# EAGLE schematic arduino (EAGLE 6.1)
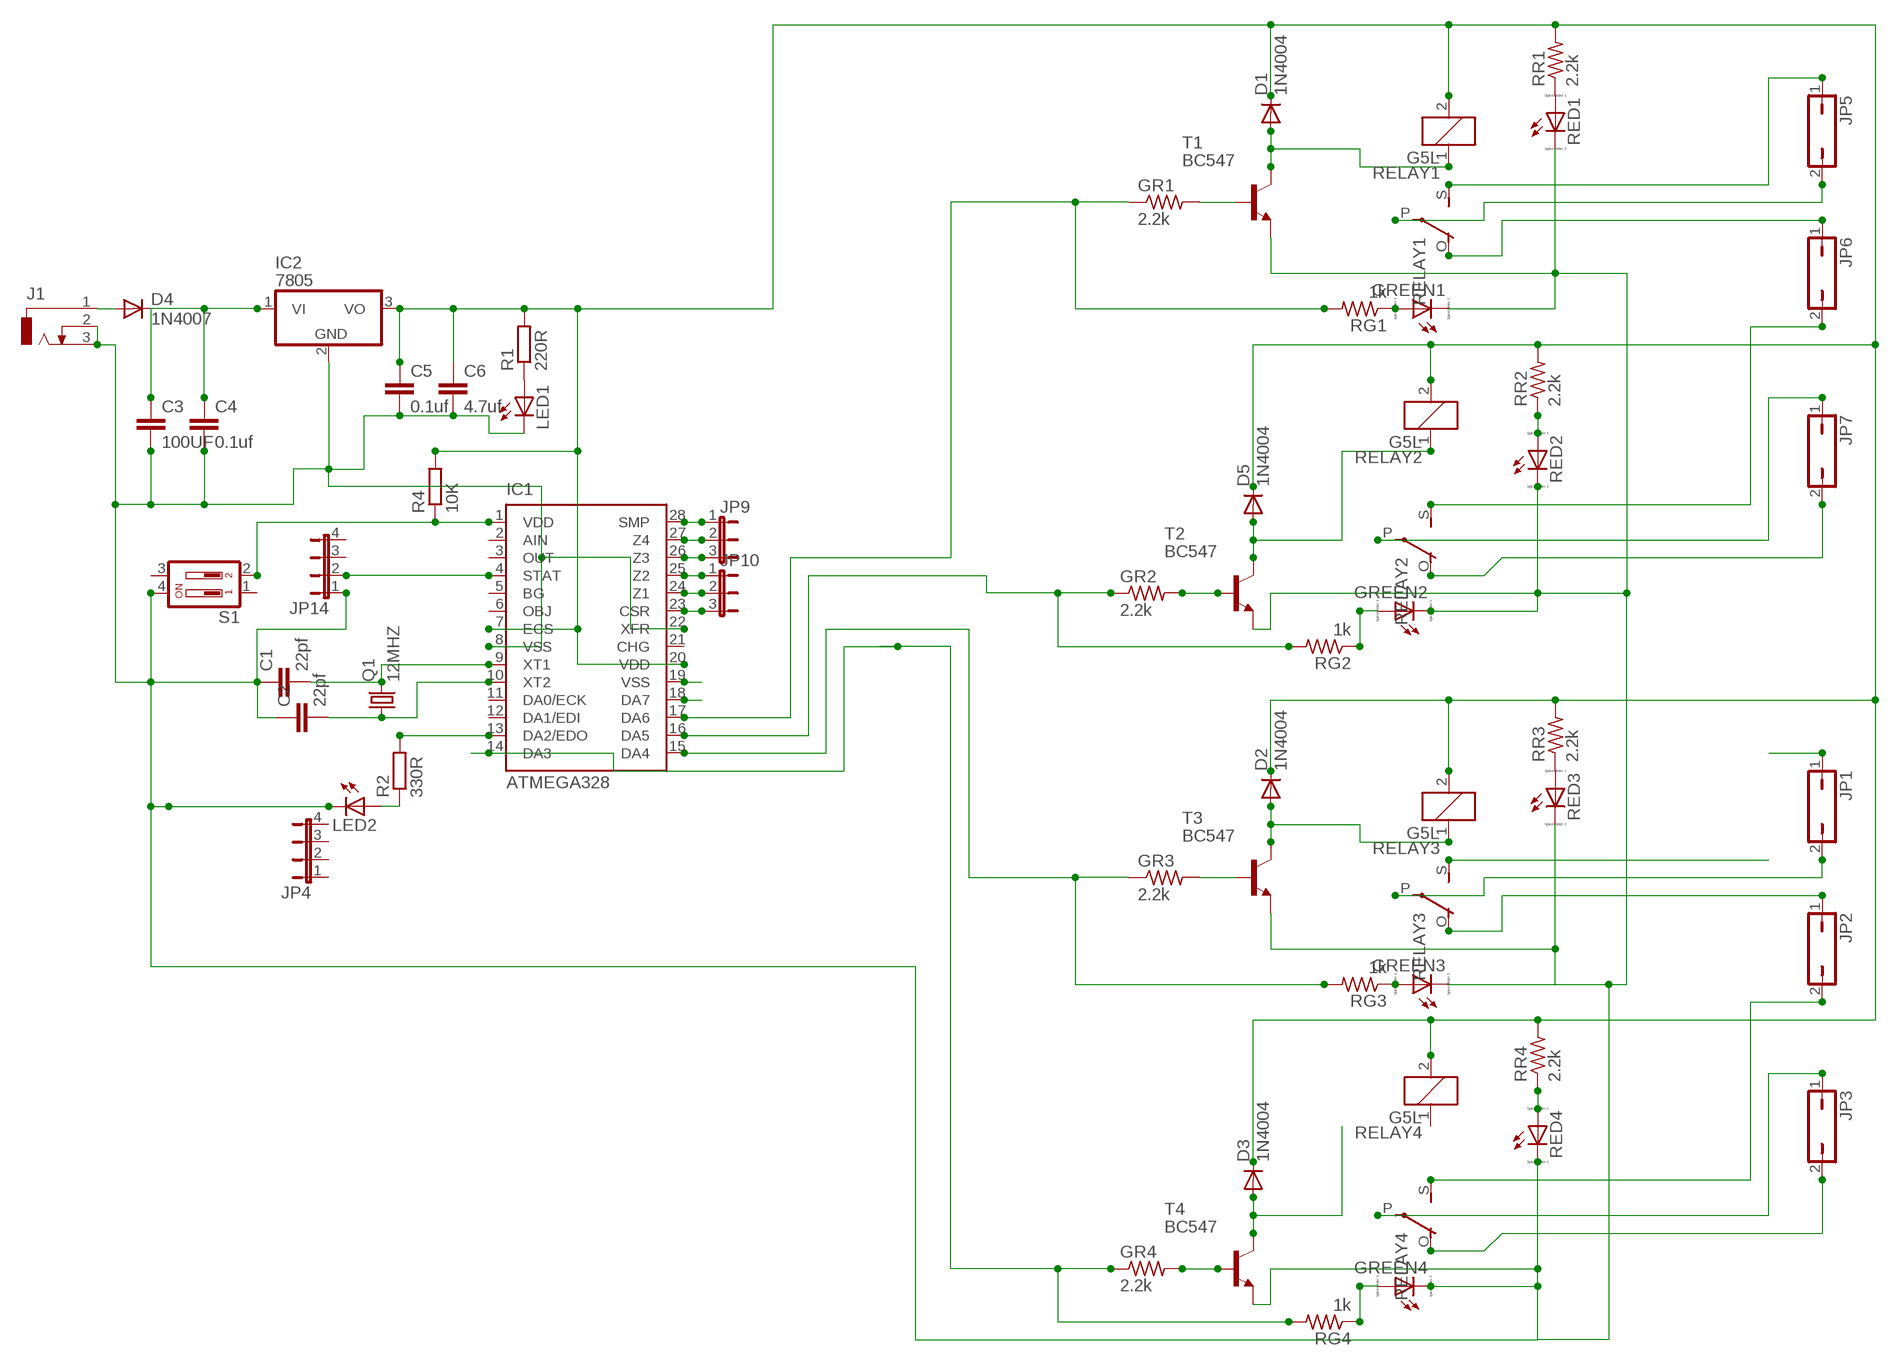
[diagram p0: schematic, sheet 1]

## Parts
C1  22pf  C2.5/2  [C2.5-2]
C2  22pf  C2.5/2  [C2.5-2]
C3  100UF  C2.5/2  [C2.5-2]
C4  0.1uf  C2.5/2  [C2.5-2]
C5  0.1uf  C2.5/2  [C2.5-2]
C6  4.7uf  C2.5/2  [C2.5-2]
D1  1N4004  [DO41-10]
D2  1N4004  [DO41-10]
D3  1N4004  [DO41-10]
D4  1N4007  1N4004  [DO41-10]
D5  1N4004  [DO41-10]
GR1  2.2k  R-US_0204/7  [0204/7]
GR2  2.2k  R-US_0204/7  [0204/7]
GR3  2.2k  R-US_0204/7  [0204/7]
GR4  2.2k  R-US_0204/7  [0204/7]
GREEN1  LED_ELD260  [LED_LD260]
GREEN2  LED_ELD260  [LED_LD260]
GREEN3  LED_ELD260  [LED_LD260]
GREEN4  LED_ELD260  [LED_LD260]
IC1  ATMEGA328  QT9701BD  [DIL28-3]
IC2  7805  786TV  [TO220V]
J1  DCJ0303  [DCJ0303]
JP1  JP1Q  [JP1]
JP2  JP1Q  [JP1]
JP3  JP1Q  [JP1]
JP4  JP4E  [JP4]
JP5  JP1Q  [JP1]
JP6  JP1Q  [JP1]
JP7  JP1Q  [JP1]
JP9  JP2E  [JP2]
JP10  JP2E  [JP2]
JP14  JP4E  [JP4]
LED1  LED3MM  [LED3MM]
LED2  LED3MM  [LED3MM]
Q1  12MHZ  CRYSTALHC49S  [HC49/S]
R1  220R  R-EU_0207/10  [0207/10]
R2  330R  R-EU_0207/10  [0207/10]
R4  10K  R-EU_0207/10  [0207/10]
RED1  LED_ELD260  [LED_LD260]
RED2  LED_ELD260  [LED_LD260]
RED3  LED_ELD260  [LED_LD260]
RED4  LED_ELD260  [LED_LD260]
RELAY1  G5L  [G5LE]
RELAY2  G5L  [G5LE]
RELAY3  G5L  [G5LE]
RELAY4  G5L  [G5LE]
RG1  1k  R-US_0204/7  [0204/7]
RG2  1k  R-US_0204/7  [0204/7]
RG3  1k  R-US_0204/7  [0204/7]
RG4  1k  R-US_0204/7  [0204/7]
RR1  2.2k  R-US_0204/7  [0204/7]
RR2  2.2k  R-US_0204/7  [0204/7]
RR3  2.2k  R-US_0204/7  [0204/7]
RR4  2.2k  R-US_0204/7  [0204/7]
S1  DP02  [DP-02]
T1  BC547  [TO92]
T2  BC547  [TO92]
T3  BC547  [TO92]
T4  BC547  [TO92]

## Nets
N$1: D1.A RELAY1.1 T1.3(C)
N$2: JP1.1
N$3: RED1.A RR1.1
N$4: C1.2 IC1.9(XT1) Q1.2
N$5: GR1.2 T1.2(B)
N$7: D5.A RELAY2.1 T2.3(C)
N$8: JP5.1 RELAY1.S(2:S)
N$9: JP6.1 RELAY1.O(2:O)
N$10: JP5.2 RELAY1.P(2:P)
N$11: GREEN1.A RG1.1
N$12: D2.A RELAY3.1 T3.3(C)
N$13: RED2.A RR2.1
N$14: C2.2 IC1.10(XT2) Q1.1
N$15: GR2.2 T2.2(B)
N$17: JP6.2 RELAY2.S(2:S)
N$18: JP7.2 RELAY2.O(2:O)
N$19: JP7.1 RELAY2.P(2:P)
N$20: GREEN2.A RG2.1
N$21: C1.1 C2.1 C3.2 C4.2 C5.2 C6.2 GREEN1.K(C) GREEN2.K(C) GREEN3.K(C) GREEN4.K(C) IC1.8(VSS) IC1.22(XFR) IC2.2(GND) J1.2 J1.3 JP14.1 LED1.K(C) LED2.K(C) RED1.K(C) RED2.K(C) RED3.K(C) RED4.K(C) S1.4 T1.1(E) T2.1(E) T3.1(E) T4.1(E)
N$22: RED3.A RR3.1
N$23: IC1.4(STAT) JP14.2
N$24: GR3.2 T3.2(B)
N$26: RELAY3.S(2:S)
N$27: JP2.1 RELAY3.O(2:O)
N$28: JP1.2 RELAY3.P(2:P)
N$29: GREEN3.A RG3.1
N$30: D3.A T4.3(C)
N$31: RED4.A RR4.1
N$32: C3.1 C4.1 D4.C IC2.1(VI)
N$33: GR4.2 T4.2(B)
N$35: JP2.2 RELAY4.S(2:S)
N$36: JP3.2 RELAY4.O(2:O)
N$37: JP3.1 RELAY4.P(2:P)
N$38: GREEN4.A RG4.1
N$39: D4.A J1.1
N$40: C5.1 C6.1 D1.C D2.C D3.C D5.C IC1.7(ECS) IC1.20(VDD) IC2.3(VO) R1.2 R4.2 RELAY1.2 RELAY2.2 RELAY3.2 RELAY4.2 RR1.2 RR2.2 RR3.2 RR4.2
N$41: LED1.A R1.1
N$42: IC1.28(SMP) JP9.1
N$43: IC1.27(Z4) JP9.2
N$44: IC1.26(Z3) JP9.3
N$45: IC1.25(Z2) JP10.1
N$46: IC1.24(Z1) JP10.2
N$47: IC1.23(CSR) JP10.3
N$55: IC1.13(DA2/EDO) R2.2
N$56: GR4.1 IC1.14(DA3) RG4.2
N$57: GR3.1 IC1.15(DA4) RG3.2
N$58: GR2.1 IC1.16(DA5) RG2.2
N$59: GR1.1 IC1.17(DA6) RG1.2
N$60: IC1.18(DA7)
N$61: IC1.19(VSS)
N$62: IC1.1(VDD) R4.1 S1.2
N$63: LED2.A R2.1
Unconnected: IC1.2(AIN) IC1.3(OUT) IC1.5(BG) IC1.6(OBJ) IC1.11(DA0/ECK) IC1.12(DA1/EDI) IC1.21(CHG) JP4.1 JP4.2 JP4.3 JP4.4 JP14.3 JP14.4 RELAY4.1 S1.1 S1.3

## Library data of the parts
C1-C6 = capacitor-wima:C: CAPACITOR naming: grid - package width
D1-D5 = diode:1N4004: DIODE general purpose rectifier, 1 A
GR1-GR4 RG1-RG4 RR1-RR4 = rcl:R-US_: RESISTOR, American symbol
GREEN1-GREEN4 RED1-RED4 = eagle-ltspice:LED_E: LED Source: http://www.osram.convergy.de Source: www.luxeon.com Source: www.kingbright.com; SPICEMODEL: NONE; SPICEPREFIX: D; SPICETYPE: diode
IC1 = quantum-research-group:QT9701B: Charge-Transfer Capacitance Sensor IC Source: http://data.qprox.com/downloads/datasheets/qt9701b.pdf; OC_FARNELL: unknown; OC_NEWARK: unknown
IC2 = linear:78*: Positive VOLTAGE REGULATOR Source: http://cache.national.com/ds/LM/LM78L05.pdf http://www.fairchildsemi.com/ds/LM/LM7805.pdf
J1 = con-jack:DCJ0303: DC POWER JACK Source: DCJ0303.pdf; OC_FARNELL: unknown; OC_NEWARK: unknown
JP1-JP3 JP5-JP7 = jumper:JP1Q: JUMPER
JP4 JP14 = jumper:JP4E: JUMPER
JP9 JP10 = jumper:JP2E: JUMPER
LED1 LED2 = led:LED: LED OSRAM: - CHIPLED LG R971, LG N971, LY N971, LG Q971, LY Q971, LO R971, LY R971 LH N974, LH R974 LS Q976, LO Q976, LY Q976 LO Q996 - Hyper CHIPLED LW Q18S LB Q993, LB Q99A, LB R99A - SideLED LS A670, LO A670, LY A670, LG A670, LP A670 LB A673, LV A673, LT A673, LW A673 LH A674 LY A675 LS A676, LA A676, LO A676, LY A676, LW A676 LS A679, LY A679, LG A679 - Hyper Micro SIDELED® LS Y876, LA Y876, LO Y876, LY Y876 LT Y87S - SmartLED LW L88C, LW L88S LB L89C, LB L89S, LG L890 LS L89K, LO L89K, LY L89K LS L896, LA L896, LO L896, LY L896 - TOPLED LS T670, LO T670, LY T670, LG T670, LP T670 LSG T670, LSP T670, LSY T670, LOP T670, LYG T670 LG T671, LOG T671, LSG T671 LB T673, LV T673, LT T673, LW T673 LH T674 LS T676, LA T676, LO T676, LY T676, LB T676, LH T676, LSB T676, LW T676 LB T67C, LV T67C, LT T67C, LS T67K, LO T67K, LY T67K, LW E67C LS E67B, LA E67B, LO E67B, LY E67B, LB E67C, LV E67C, LT E67C LW T67C LS T679, LY T679, LG T679 LS T770, LO T770, LY T770, LG T770, LP T770 LB T773, LV T773, LT T773, LW T773 LH T774 LS E675, LA E675, LY E675, LS T675 LS T776, LA T776, LO T776, LY T776, LB T776 LHGB T686 LT T68C, LB T68C - Hyper Mini TOPLED® LB M676 - Mini TOPLED Santana® LG M470 LS M47K, LO M47K, LY M47K Source: http://www.osram.convergy.de LUXEON: - LUMILED® LXK2-PW12-R00, LXK2-PW12-S00, LXK2-PW14-U00, LXK2-PW14-V00 LXK2-PM12-R00, LXK2-PM12-S00, LXK2-PM14-U00 LXK2-PE12-Q00, LXK2-PE12-R00, LXK2-PE12-S00, LXK2-PE14-T00, LXK2-PE14-U00 LXK2-PB12-K00, LXK2-PB12-L00, LXK2-PB12-M00, LXK2-PB14-N00, LXK2-PB14-P00, LXK2-PB14-Q00 LXK2-PR12-L00, LXK2-PR12-M00, LXK2-PR14-Q00, LXK2-PR14-R00 LXK2-PD12-Q00, LXK2-PD12-R00, LXK2-PD12-S00 LXK2-PH12-R00, LXK2-PH12-S00 LXK2-PL12-P00, LXK2-PL12-Q00, LXK2-PL12-R00 Source: www.luxeon.com KINGBRIGHT: KA-3528ASYC Source: www.kingbright.com
Q1 = crystal:CRYSTAL: CRYSTAL; OC_FARNELL: 1667008; OC_NEWARK: unknown
R1 R2 R4 = rcl:R-EU_: RESISTOR, European symbol
RELAY1-RELAY4 = relay:G5L: RELAY 1 x switch, 10 A/120 V AC, 8 A/30 V ADC, Omron; OC_FARNELL: unknown; OC_NEWARK: unknown
S1 = switch-dil:DP02: DIL/CODE SWITCH; MPN: MCDP02; OC_FARNELL: 1255233; OC_NEWARK: 26M1095
T1-T4 = transistor:BC547: NPN TRANSISTOR